# EAGLE design electron_mpu9250_analog_mic (EAGLE 8.3.2)
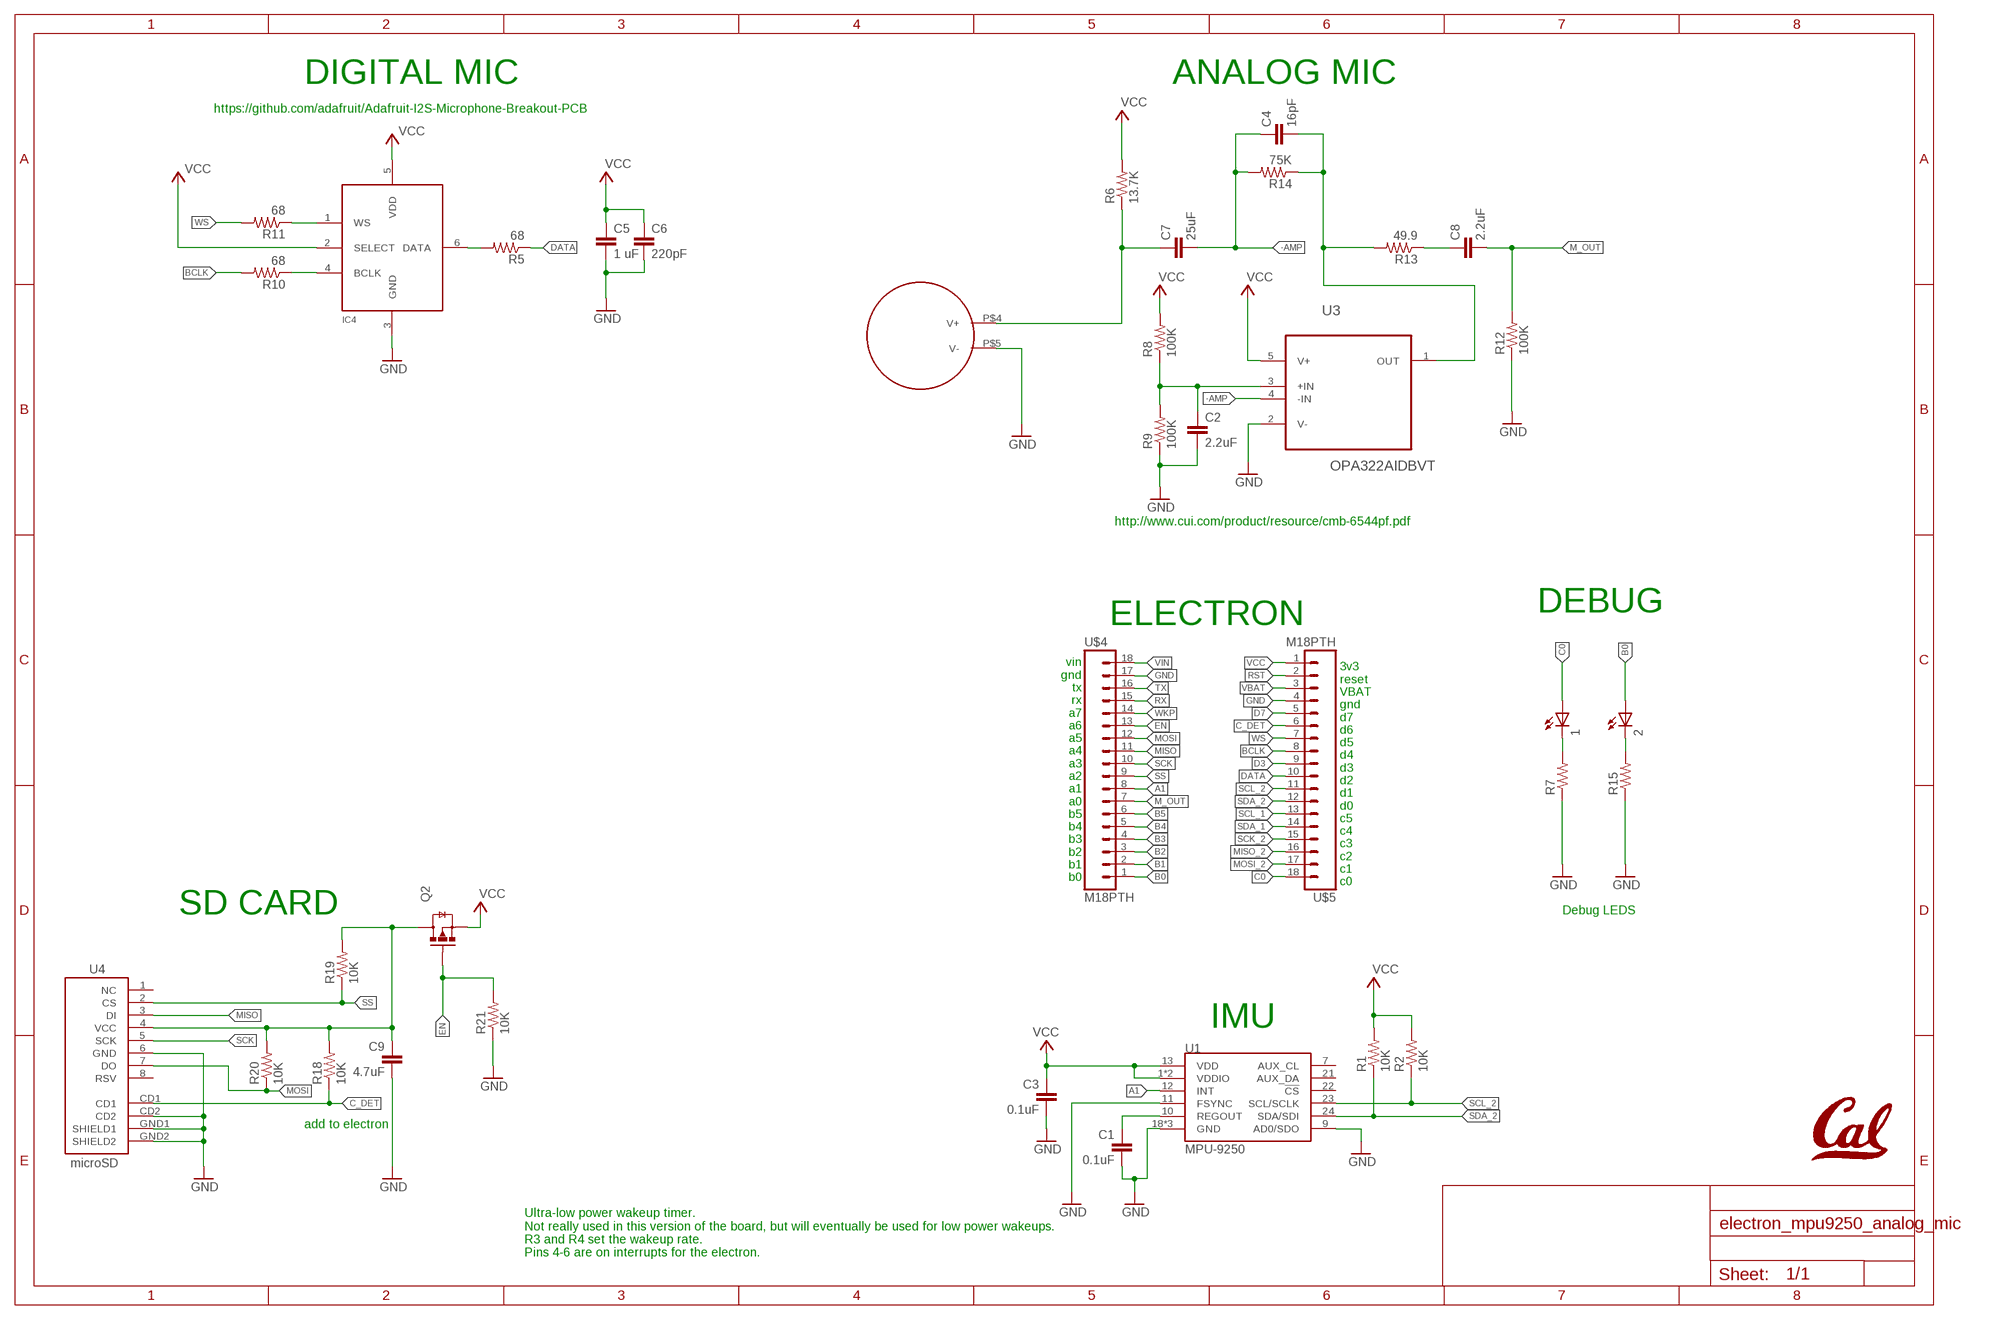
[diagram p0: schematic, sheet 1]

## Parts
1  LEDCHIP-LED0603  [CHIP-LED0603]
2  LEDCHIP-LED0603  [CHIP-LED0603]
C1  0.1uF  0.1UF-25V(+80/-20%)(0603)  [0603-CAP]
C2  2.2uF  C-EUC0603  [C0603]
C3  0.1uF  0.1UF-25V(+80/-20%)(0603)  [0603-CAP]
C4  16pF  C-EUC0603  [C0603]
C5  1 uF  C-EUC0603  [C0603]
C6  220pF  C-EUC0603  [C0603]
C7  25uF  C-EUC0603  [C0603]
C8  2.2uF  C-EUC0603  [C0603]
C9  4.7uF  0.1UF-25V(+80/-20%)(0603)  [0603-CAP]
IC4  MIC_I2S_SPH0645  [SPH0645LM4H]
L1  UCB_CAL100MIL  [UCB_CAL_100MIL]
Q2  NX3008PBK  [SOT23-3]
R1  10K  10KOHM-1/10W-1%(0603)0603  [0603-RES]
R2  10K  10KOHM-1/10W-1%(0603)0603  [0603-RES]
R5  68  R-US_R0603  [R0603]
R6  13.7K  R-US_R0603  [R0603]
R7  R-US_R0603  [R0603]
R8  100K  R-US_R0603  [R0603]
R9  100K  R-US_R0603  [R0603]
R10  68  R-US_R0603  [R0603]
R11  68  R-US_R0603  [R0603]
R12  100K  R-US_R0603  [R0603]
R13  49.9  R-US_R0603  [R0603]
R14  75K  R-US_R0603  [R0603]
R15  R-US_R0603  [R0603]
R18  10K  R-US_R0603  [R0603]
R19  10K  R-US_R0603  [R0603]
R20  10K  R-US_R0603  [R0603]
R21  10K  R-US_R0603  [R0603]
U1  MPU-9250  [QFN24_PAD]
U3  OPA322AIDBVT  [SOT95P280X145-5N]
U4  microSD  USD-SOCKETSMD  [MICRO-SD-SOCKET-PP]
U$1  CMB-6544PF  [CMB-6544PF]
U$4  M18PTH  [1X18-SMALL-PADS]
U$5  M18PTH  [1X18-SMALL-PADS]

## Nets
-AMP: C4.1 C7.2 R14.2 U3.4(-IN)
A1: U1.12(INT) U$4.8
B0: 2.A U$4.1
B1: U$4.2
B2: U$4.3
B3: U$4.4
B4: U$4.5
B5: U$4.6
BCLK: R10.2 U$5.8
C0: 1.A U$5.18
C_DET: R18.1 U4.CD1 U$5.6
D3: U$5.9
D7: U$5.5
DATA: R5.1 U$5.10
EN: Q2.1(G) R21.2 U$4.13
GND: C1.2 C2.2 C3.2 C5.2 C6.2 C9.2 IC4.3(GND) R7.1 R9.1 R12.1 R15.1 R21.1 U1.9(AD0/SDO) U1.11(FSYNC) U1.18(GND) U1.20(GND) U1.CENTER(GND) U3.2(V-) U4.6(GND) U4.CD2 U4.GND1(SHIELD1) U4.GND2(SHIELD2) U$1.P$5(V-) U$4.17 U$5.4
M_OUT: C8.2 R12.2 U$4.7
MISO: U4.3(DI) U$4.11
MISO_2: U$5.16
MOSI: R20.1 U4.7(DO) U$4.12
MOSI_2: U$5.17
N$1: C7.1 R6.1 U$1.P$4(V+)
N$2: IC4.1(WS) R11.1
N$3: C4.2 R13.2 R14.1 U3.1(OUT)
N$4: IC4.4(BCLK) R10.1
N$5: 1.C R7.2
N$6: IC4.6(DATA) R5.2
N$7: C8.1 R13.1
N$8: 2.C R15.2
N$9: C2.1 R8.1 R9.2 U3.3(+IN)
N$10: C9.1 Q2.3(D) R18.2 R19.2 R20.2 U4.4(VCC)
REGOUT: C1.1 U1.10(REGOUT)
RST: U$5.2
RX: U$4.15
SCK: U4.5(SCK) U$4.10
SCK_2: U$5.15
SCL_1: U$5.13
SCL_2: R2.1 U1.23(SCL/SCLK) U$5.11
SDA_1: U$5.14
SDA_2: R1.1 U1.24(SDA/SDI) U$5.12
SS: R19.1 U4.2(CS) U$4.9
TX: U$4.16
VBAT: U$5.3
VCC: C3.1 C5.1 C6.1 IC4.2(SELECT) IC4.5(VDD) Q2.2(S) R1.2 R2.2 R6.2 R8.2 U1.1(VDDIO) U1.8(VDDIO) U1.13(VDD) U3.5(V+) U$5.1
VIN: U$4.18
WKP: U$4.14
WS: R11.2 U$5.7
Unconnected: U1.7(AUX_CL) U1.21(AUX_DA) U1.22(!CS) U4.1(NC) U4.8(RSV)

## Notes on the sheet
- DIGITAL MIC | ANALOG MIC
- https://github.com/adafruit/Adafruit-I2S-Microphone-Breakout-PCB
- http://www.cui.com/product/resource/cmb-6544pf.pdf
- DEBUG
- ELECTRON
- vin
  gnd
  tx
  rx
  a7
  a6
  a5
  a4
  a3
  a2
  a1
  a0
  b5
  b4
  b3
  b2
  b1
  b0
- 3v3
  reset
  VBAT
  gnd
  d7
  d6
  d5
  d4
  d3
  d2
  d1
  d0
  c5
  c4
  c3
  c2
  c1
  c0
- SD CARD | Debug LEDS
- IMU
- add to electron
- Ultra-low power wakeup timer.
  Not really used in this version of the board, but will eventually be used for low power wakeups. 
  R3 and R4 set the wakeup rate. 
  Pins 4-6 are on interrupts for the electron.

## Library data of the parts
1 2 = adafruit:LED: LED OSRAM: - CHIPLED LG R971, LG N971, LY N971, LG Q971, LY Q971, LO R971, LY R971 LH N974, LH R974 LS Q976, LO Q976, LY Q976 LO Q996 - Hyper CHIPLED LW Q18S LB Q993, LB Q99A, LB R99A - SideLED LS A670, LO A670, LY A670, LG A670, LP A670 LB A673, LV A673, LT A673, LW A673 LH A674 LY A675 LS A676, LA A676, LO A676, LY A676, LW A676 LS A679, LY A679, LG A679 - Hyper Micro SIDELED® LS Y876, LA Y876, LO Y876, LY Y876 LT Y87S - SmartLED LW L88C, LW L88S LB L89C, LB L89S, LG L890 LS L89K, LO L89K, LY L89K LS L896, LA L896, LO L896, LY L896 - TOPLED LS T670, LO T670, LY T670, LG T670, LP T670 LSG T670, LSP T670, LSY T670, LOP T670, LYG T670 LG T671, LOG T671, LSG T671 LB T673, LV T673, LT T673, LW T673 LH T674 LS T676, LA T676, LO T676, LY T676, LB T676, LH T676, LSB T676, LW T676 LB T67C, LV T67C, LT T67C, LS T67K, LO T67K, LY T67K, LW E67C LS E67B, LA E67B, LO E67B, LY E67B, LB E67C, LV E67C, LT E67C LW T67C LS T679, LY T679, LG T679 LS T770, LO T770, LY T770, LG T770, LP T770 LB T773, LV T773, LT T773, LW T773 LH T774 LS E675, LA E675, LY E675, LS T675 LS T776, LA T776, LO T776, LY T776, LB T776 LHGB T686 LT T68C, LB T68C - Hyper Mini TOPLED® LB M676 - Mini TOPLED Santana® LG M470 LS M47K, LO M47K, LY M47K Source: http://www.osram.convergy.de/
C1 C3 = SparkFun-Capacitors:0.1UF-25V(+80/-20%)(0603): CAP-00810 Ceramic Standard decoupling cap; PROD_ID: CAP-00810
C2 C4-C8 = resistor:C-EU: CAPACITOR, European symbol
C9 = SparkFun-Capacitors:0.1UF-25V(+80/-20%)(0603): CAP-00810 Ceramic Standard decoupling cap; PROD_ID: CAP-00810; VALUE: 0.1uF
IC4 = microbuilder:MIC_I2S
L1 = logos:UCB_CAL
Q2 = fets:NX3008PBK: MOSFET - P Channel; DIGIKEY: 568-10499-1-ND; MOUSER: 771-NX3008PBK,215; NEWARK: 74T4665
R1 R2 = SparkFun-Resistors:10KOHM-1/10W-1%(0603): RES-00824; PROD_ID: RES-00824
R5-R15 R18-R21 = resistor:R-US_: RESISTOR, American symbol
U1 = Testing:MPU-9250: NC pin 19. 2-6 & 14-17 not internally connected. May be used for PCB trace routing.; PROD_ID: IC-13192
U3 = OPA322AIDBVT:OPA322AIDBVT: Operational Amplifier; AVAILABILITY: Good; DESCRIPTION: 20MHz, Low Noise, 1.8V RRIO, CMOS Operational Amplifier with Shutdown 5-SOT-23 -40 to 125; MF: Texas Instruments; MP: OPA322AIDBVT; PACKAGE: SOT-23 Texas Instruments; PRICE: 1.26 USD
U4 = SparkFun:USD-SOCKET: microSD Socket Push-push type uSD socket. Schematic element and footprint production proven. Spark Fun Electronics SKU : PRT-00127. tDoc lines correctly indicate media card edge positions when inserting (unlocked, locked, depressed).
U$1 = microphone:CMB-6544PF: 20HZ-20KHZ Electret Condenser Microphone https://www.digikey.com/en/ptm/c/cui-inc/electret-condenser-microphones?pn_sku=102-1722-ND&part_id=1869982
U$4 U$5 = Particle:M18

## Board
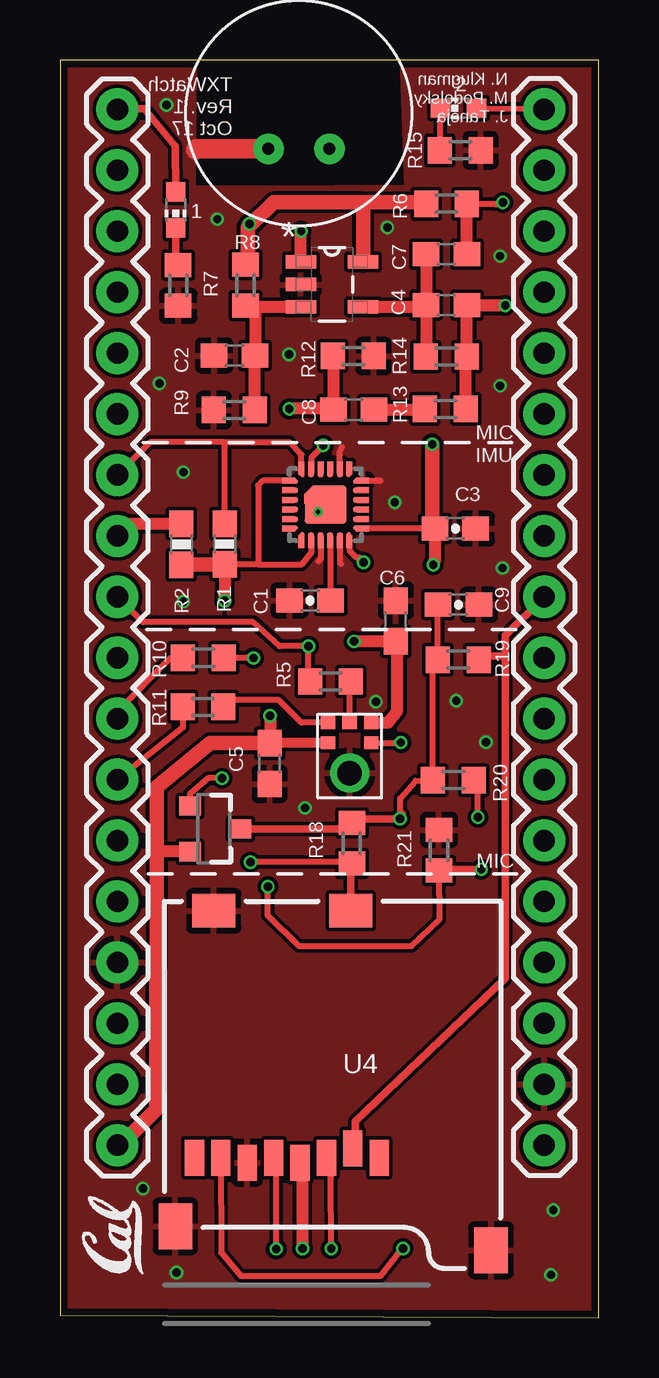
[diagram p1: board, top side]
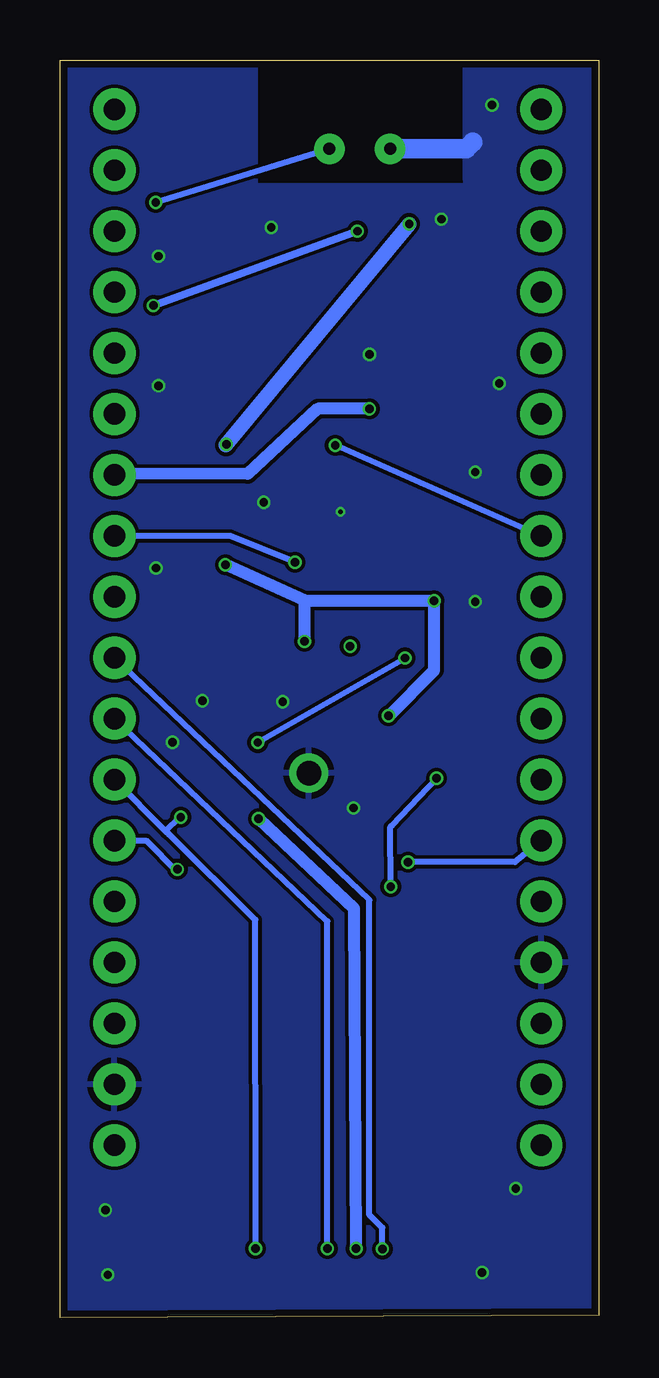
[diagram p2: board, bottom side, seen from below]

Size 22.44 x 52.43 mm. Coordinates in mm from the lower left corner, seen from the top.
Outline: 0,0.1 22.44,0 22.44,52.43 0,52.43 0,0.1
Copper layers (1*16): Top 0.0178mm / dielectric 59mil / Bottom 0.0178mm
Design rules "quickturn_co_kr_1oz": minimum track width 4mil, minimum drill 0.200659375mm, track to track 6mil, track to pad 6mil, pad to pad 6mil, via to via 6mil, smd to smd 6mil, copper to edge 12mil, drill to drill 12mil, minimum pad ring 8mil, minimum via ring 4mil, stop-mask expansion 3mil, vias tented up to drill 50mil, thermal gap 10mil

### Footprints (pad centres in the part's own frame; a part is rotated, then mirrored left to right if it is on the bottom)
CHIP-LED0603 = smd 0.8 x 0.8: A 0,-0.75; C 0,0.75
0603-CAP = smd 1.1 x 1: 1 -0.85,0; 2 0.85,0
C0603 = smd 1.1 x 1: 1 -0.85,0; 2 0.85,0
SPH0645LM4H = smd 0.6 x 0.525: 1 -0.9,1.4; 2 -0.9,0.55; 4 0.9,0.55; 5 0.9,1.4; 6 0,1.4 | drill 1.025 pad 1.625: 3 0,-0.71
SOT23-3 = smd 0.8 x 0.9: 1 -0.95,-1; 2 0.95,-1; 3 0,1.1
0603-RES = smd 1.1 x 1: 1 -0.85,0; 2 0.85,0
R0603 = smd 1 x 1.1: 1 -0.85,0; 2 0.85,0
QFN24_PAD = smd 0.5 x 0.25: 1 -1.55,1; 2 -1.55,0.6; 3 -1.55,0.2; 4 -1.55,-0.2; 5 -1.55,-0.6; 6 -1.55,-1; 13 1.55,-1; 14 1.55,-0.6; 15 1.55,-0.2; 16 1.55,0.2; 17 1.55,0.6; 18 1.55,1 | smd 0.08 x 0.13: 1$1 -1.32,1.06; 1$3 -1.26,0.94; P$33 1.26,-0.94; P$34 1.32,-1.06; P$58 1.26,0.94; P$59 1.32,1.06; P$68 -1.26,-0.94; P$69 -1.32,-1.06 | smd 0.1 x 0.185 rotated 45: 1$2 -1.25,1.024; P$49 1.024,-1.25 | smd 0.14 x 0.14: 1$4 -1.22,0.945; P$23 -0.945,-1.22; P$24 1.22,-0.945; P$36 0.945,1.22; P$51 0.945,-1.22; P$56 1.22,0.945; P$61 -0.945,1.22; P$66 -1.22,-0.945 | smd 0.05 x 0.05: 1$5 -1.175,0.97; P$25 -0.97,-1.175; P$31 1.175,-0.97; P$37 0.97,1.175; P$52 0.97,-1.175; P$57 1.175,0.97; P$62 -0.97,1.175; P$67 -1.175,-0.97 | smd 0.25 x 0.5: 7 -1,-1.55; 8 -0.6,-1.55; 9 -0.2,-1.55; 10 0.2,-1.55; 11 0.6,-1.55; 12 1,-1.55; 19 1,1.55; 20 0.6,1.55; 21 0.2,1.55; 22 -0.2,1.55; 23 -0.6,1.55; 24 -1,1.55 | smd 0.25 x 0.25: CENTER 0,0 | smd 0.4 x 0.4: DBBADFE -0.675,0.24 | smd 0.6 x 1.2: DBBADFE1 -0.575,-0.195 | smd 0.25 x 0.3: P$1 -0.2,1.3; P$3 0.2,1.3; P$5 0.6,1.3; P$11 -0.6,1.3; P$16 0.2,-1.3; P$18 -0.2,-1.3; P$20 -0.6,-1.3; P$26 0.6,-1.3 | smd 0.3 x 0.25: P$2 -1.3,0.2; P$4 -1.3,0.6; P$28 -1.3,-0.2; P$38 -1.3,-0.6; P$40 1.3,0.2; P$42 1.3,-0.2; P$44 1.3,-0.6; P$50 1.3,0.6 | smd 0.1 x 0.185 rotated 225: P$7 1.25,-1.024; P$60 -1.024,1.25 | smd 1.1 x 1.59: P$13 0.325,0 | smd 0.3 x 0.5 rotated 315: P$14 -0.592,0.512 | smd 0.5 x 1.59: P$15 -0.27,0 | smd 0.1 x 0.185 rotated 135: P$22 -1.024,-1.25; P$55 1.25,1.024 | smd 0.13 x 0.08: P$27 -0.94,-1.26; P$29 -1.06,-1.32; P$39 0.94,1.26; P$41 1.06,1.32; P$53 0.94,-1.26; P$54 1.06,-1.32; P$63 -0.94,1.26; P$64 -1.06,1.32 | smd 0.1 x 0.185 rotated 315: P$35 1.024,1.25; P$65 -1.25,-1.024
SOT95P280X145-5N = smd 1.27 x 0.559: 1 -1.295,0.94; 2 -1.295,0; 3 -1.295,-0.94; 4 1.295,-0.94; 5 1.295,0.94
MICRO-SD-SOCKET-PP = smd 0.8 x 1.5: 1 -8.94,10.7; 2 -7.84,10.3; 3 -6.74,10.7; 4 -5.64,10.9; 5 -4.54,10.7; 6 -3.44,10.9; 7 -2.34,10.7; 8 -1.24,10.7 | smd 1.8 x 1.4: CD1 -7.75,0.4; CD2 -2.05,0.4 | smd 1.4 x 1.9: GND1 -13.6,14.55; GND2 -0.45,13.55
CMB-6544PF = drill 0.5 pad 1.27: P$4 1.5,1.27; P$5 1.5,-1.27
1X18-SMALL-PADS = drill 0.889 pad 1.753: 1 -20.32,0; 2 -17.78,0; 3 -15.24,0; 4 -12.7,0; 5 -10.16,0; 6 -7.62,0; 7 -5.08,0; 8 -2.54,0; 9 0,0; 10 2.54,0; 11 5.08,0; 12 7.62,0; 13 10.16,0; 14 12.7,0; 15 15.24,0; 16 17.78,0; 17 20.32,0; 18 22.86,0

### Placement (x,y rotation side)
1  4.82,46.18 180 top
2  16.6,50.41 90 top
C1  10.42,29.9 180 top
C2  7.27,40.11 180 top
C3  16.47,32.89 0 top
C4  16.1,42.2 0 top
C5  8.73,23.1 270 top
C6  13.99,29.04 90 top
C7  16.1,44.34 180 top
C8  12.24,37.85 180 top
C9  16.6,29.72 0 top
IC4  12.07,23.41 0 top
L1  3.46,1.83 90 top
Q2  6.41,20.38 270 top
R1  6.86,32.25 270 top
R2  5.06,32.24 270 top
R5  11.27,26.52 0 top
R6  16.1,46.43 180 top
R7  4.92,43.03 90 top
R8  7.73,43.04 90 top
R9  7.26,37.84 0 top
R10  5.97,27.51 180 top
R11  5.96,25.46 180 top
R12  12.22,40.09 180 top
R13  16.05,37.88 0 top
R14  16.09,40.06 180 top
R15  16.68,48.66 180 top
R18  12.16,19.78 90 top
R19  16.59,27.43 180 top
R20  16.39,22.41 180 top
R21  15.79,19.49 270 top
U1  11.06,33.89 0 top
U3  11.33,43.07 0 top
U4  4.36,17.36 180 top
U$1  9.95,50.22 270 top
U$4  20.17,30.05 270 top
U$5  2.39,27.51 90 top

### Tracks (layer width: path | path; a pad name or v marks a point on that pad's centre or on a via)
-AMP
  Top 0.508: 15.18,42.13 U3.4 | 15.18,42.13 C4.1 | C7.2 C4.1 | C4.1 15.18,42.13 | C4.1 R14.2
A1  (via drill 0.35)
  Top 0.254: U1.12 12.06,31.98 12.35,31.69 12.45,31.69 v12.65,31.49
  Bottom 0.254: v12.65,31.49 15.35,32.59 U$4.8
B0
  Top 0.254: 2.A 20.14,50.4 U$4.1
BCLK
  Top 0.254: U$5.8 2.43,25.32 4.58,27.48 5.1,27.49 R10.2
C0
  Top 0.254: 2.41,50.39 U$5.18
  Top 0.305: 1.A 4.81,48.83 3.51,50.39 2.41,50.39
C_DET  (via drill 0.35)
  Top 0.254: 12.14,18.99 11.75,18.99 | 11.75,18.99 v7.94,18.99 | 11.75,18.99 12.31,18.99 R18.1
  Top 0.305: U4.CD1 12.11,18.79 R18.1
  Bottom 0.254: U$5.6 3.49,18.99 v7.94,18.99
DATA  (via drill 0.35)
  Top 0.254: R5.1 10.36,26.68 10.35,26.79 v10.35,27.99 9.15,27.99 8.05,28.99 3.45,28.99 U$5.10
  Bottom 0.254: 2.55,30.09 U$5.10
EN  (via drill 0.35)
  Top 0.254: 15.7,18.69 R21.2 15.8,16.59 14.65,15.49 9.95,15.49 8.65,16.78 v8.66,17.97 | v6.75,22.49 6.17,22.49 5.41,21.83 Q2.1
  Top 0.305: v17.55,18.69 15.7,18.69
  Bottom 0.254: U$4.13 18.85,19.89 17.55,18.59 v17.55,18.69 | v6.75,22.49 8.61,20.51 8.67,20.46 v8.66,17.97
GND  (via drill 0.2, 0.35)
  Top 0.254: U1.20 11.66,36.11 11.75,36.29 | U1.18 13.35,34.89 | v10.75,33.59 v10.76,33.59 U1.CENTER | U1.9 10.86,31.62 10.77,31.53 | U1.11 11.66,31.47 11.7,31.43
  Top 0.813: U$1.P$5 5.68,48.72 5.65,48.69
  Bottom 0.813: U$1.P$5 5.52,48.72 5.25,48.99
  other vias: 6.55,45.79 13.95,33.99 5.14,29.85 18.44,31.25 17.75,23.99 3.45,5.39 16.51,25.72 10.21,21.25 4.85,1.89 20.45,1.79 5.14,35.25 18.34,38.85 4.44,50.55 13.16,25.68 20.55,4.49 18.34,44.25 13.64,45.45 9.54,40.15 4.14,38.95
  pour Top: -1.31,52.4 5.58,52.52 5.54,47.1 arc1 14.46,47.13 14.25,53.15 24.22,53.68 22.63,-61.21 -1.66,-60.44
  pour Bottom: 0.11,56.69 4.35,56.42 5.57,56.78 5.55,47.51 5.52,47.17 14.31,47.17 14.31,57.17 23.24,56.87 23.47,56.64 23.47,3.15 22.79,-62.37 -1.23,-62.37 -2.97,3.46 -2.97,56.56 -0.78,56.64
M_OUT  (via drill 0.35)
  Top 0.508: C8.2 R12.2 | 11.34,37.89 C8.2 | C8.2 11.13,37.89 v9.55,37.89
  Bottom 0.508: v9.55,37.89 11.7,37.89 14.62,35.17 20.11,35.19 U$4.7
MISO  (via drill 0.35)
  Top 0.254: v11.3,2.89 11.29,5.87 U4.3
  Bottom 0.254: v11.3,2.89 11.3,16.53 U$4.11
MOSI  (via drill 0.35)
  Top 0.254: 20.15,22.41 U$4.12 | U4.7 6.71,2.72 7.54,1.74 13.36,1.74 14.25,2.89 v14.29,2.88 | R20.1 17.29,22.21 17.41,22.09 v17.41,20.86
  Bottom 0.254: v14.29,2.88 14.3,16.59 17.89,20.14 18.05,20.3 | 18.05,20.3 U$4.12 | v17.41,20.86 17.48,20.86 18.05,20.3
N$1  (via drill 0.35)
  Top 0.254: R6.1 18.13,46.43 18.14,46.42 18.38,46.42 v18.45,46.49
  Top 0.508: C7.1 R6.1
  Bottom 0.254: v18.45,46.49 U$1.P$4
N$2
  Top 0.254: IC4.1 10.06,24.81 9.12,25.75 7.22,25.75 R11.1
N$3  (via drill 0.35)
  Top 0.508: R13.2 16.9,40.02 R14.1 C4.2 v18.55,42.19 | U3.1 10.04,45.3 | 10.04,45.3 10.02,45.32 | 10.04,45.3 v10.05,45.29
  Bottom 0.305: v10.05,45.29 v18.55,42.19
N$4  (via drill 0.35)
  Top 0.254: IC4.4 14.18,23.96 14.19,23.95 14.19,23.94 v14.2,23.98 | v8.06,27.5 7.93,27.51 R10.1
  Bottom 0.254: 14,24.08 v14.2,23.98 8.18,27.42 v8.06,27.5
N$5
  Top 0.254: 4.82,43.98 R7.2
  Top 0.305: 1.C 4.82,43.98
N$6
  Top 0.254: IC4.6 12.07,26.5 R5.2
N$7
  Top 0.508: C8.1 15.17,37.85 R13.1
N$8
  Top 0.254: R15.2 2.C
N$9
  Top 0.508: 8.13,42.09 R8.1 | 8.13,42.09 C2.1 R9.2 | U3.3 8.17,42.13 8.13,42.09
N$10  (via drill 0.35)
  Top 0.254: 15.65,22.39 15.64,22.4 | 15.64,22.4 R20.2 | 15.46,22.49 R20.2 | R20.2 15.54,27.5 R19.2 C9.1 15.56,29.69 | v14.17,20.8 14.17,21.65 14.82,22.38 15.63,22.39 15.64,22.4 | U4.4 10,6.44 10.1,6.34 | R18.2 12.46,20.7 12.55,20.79
  Top 0.305: 12.45,20.79 12.55,20.79 v14.17,20.8 14.25,20.99 | Q2.3 11.91,20.38 R18.2 12.51,20.89
  Top 0.508: 10.1,6.34 v10.1,2.89
  Top 0.61: 15.65,22.39
  Bottom 0.508: v10.1,2.89 10.18,17.05 14.15,20.79 v14.17,20.8
REGOUT
  Top 0.254: U1.10 C1.1
SCK  (via drill 0.35)
  Top 0.254: U4.5 9,6.19 9.02,6.17 v9.01,2.87
  Bottom 0.254: U$4.10 9.54,17.41 9.55,17.4 9.55,4.29 9.01,3.75 v9.01,2.87
SCL_2  (via drill 0.35)
  Top 0.254: U1.23 10.48,35.87 v10.97,36.36
  Top 0.508: R2.1 2.89,33.09 U$5.11
  Bottom 0.254: v10.97,36.36 10.9,36.35 U$5.11
SDA_2
  Top 0.254: U1.24 10.06,35.98 9.55,36.49 6.85,36.49 | 6.85,36.49 3.75,36.49 U$5.12 | R1.1 6.86,36.48 6.85,36.49
SS
  Top 0.254: 12.31,7.39 U4.2 | 18.5,27.54 18.55,27.59 | 17.6,27.59 R19.1
  Top 0.305: 12.31,7.39 12.31,8.19 18.55,14.15 18.55,27.59 | 18.55,27.59 18.55,28.43 U$4.9 | 18.55,27.59 17.6,27.59
VCC  (via drill 0.35)
  Top 0.254: 9.09,23.96 C5.1 | U1.13 15.45,32.89 C3.1 15.66,32.89 | 6.95,31.49 R1.2 8.25,31.4 | U1.1 8.45,34.89 8.25,34.69 8.25,31.4 | 8.25,31.4 10.06,31.4 10.46,31.89 U1.8
  Top 0.305: 4.09,19.43 4.03,19.39
  Top 0.406: IC4.2 9.09,23.96
  Top 0.508: 2.36,7.38 U$5.1 2.51,7.19 2.61,7.29 | C5.1 8.92,23.79 8.75,23.96 v8.75,25.09 | R1.2 6.95,31.49 | R8.2 7.83,44.17 | 7.82,45.46 v7.89,45.59 | 15.19,46.49 R6.2 | 12.62,46.41 12.55,46.49 | 4,9.69 | Q2.2 4.09,19.43 | IC4.5 13.67,24.81 14.05,25.29 14.05,27.53 13.99,28.13 | R1.2 6.86,30.2 6.85,30.19 v6.85,29.89 | 13.99,28.13 C6.1 | v12.25,28.19 13.94,28.19 13.99,28.13 | C3.1 15.62,31.62 v15.55,31.39
  Top 0.61: R2.2 R1.2 | 7.83,44.17 7.82,45.46 | v7.89,45.59 7.96,45.59 8.91,46.49 12.55,46.49 15.19,46.49 | U3.5 12.62,46.41 | C5.1 6.26,23.95 4.04,22.13 4.03,19.39 4,9.69 4,9.37 4.01,9.36 4.01,8.69 2.61,7.29 | 15.65,32.86 C3.1 | 15.51,32.95 v15.51,36.4 | 15.51,32.95 15.45,32.89 | 15.56,32.9 15.51,32.95 | U$5.1 2.45,7.19
  Bottom 0.508: v15.51,36.4 15.53,36.37 | v8.75,25.09 6.85,26.99 v6.85,29.89 12.25,29.89 | 12.25,29.89 v15.55,31.39 | v12.25,28.19 12.25,29.89
  Bottom 0.61: 15.53,36.37 v7.89,45.59
WS
  Top 0.254: R11.2 5.12,24.61 U$5.7

### Text on the board
tNames: TXWatch / Rev. 1 / Oct 17 | N. Klugman / M. Podolsky / J. Taneja | MIC | IMU | MIC